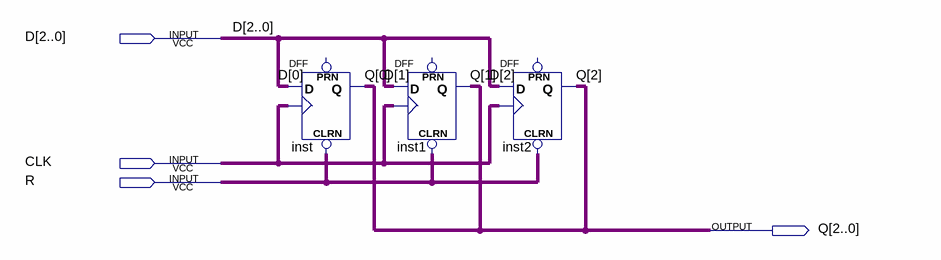
[diagram p0: schematic sheet]
// Quartus schematic registerx3.bdf as structural Verilog: 3 symbols, 4 pins
module registerx3 (
  input  [2:0] D,
  input  CLK,
  input  R,
  output [2:0] Q
);

  DFF inst (.CLRN(R), .CLK(CLK), .D(D[0]), .Q(Q[0]));  // open: PRN
  DFF inst1 (.CLRN(R), .CLK(CLK), .D(D[1]), .Q(Q[1]));  // open: PRN
  DFF inst2 (.CLRN(R), .CLK(CLK), .D(D[2]), .Q(Q[2]));  // open: PRN
endmodule
